# EAGLE design eeZeePower (EAGLE 7.1.0)
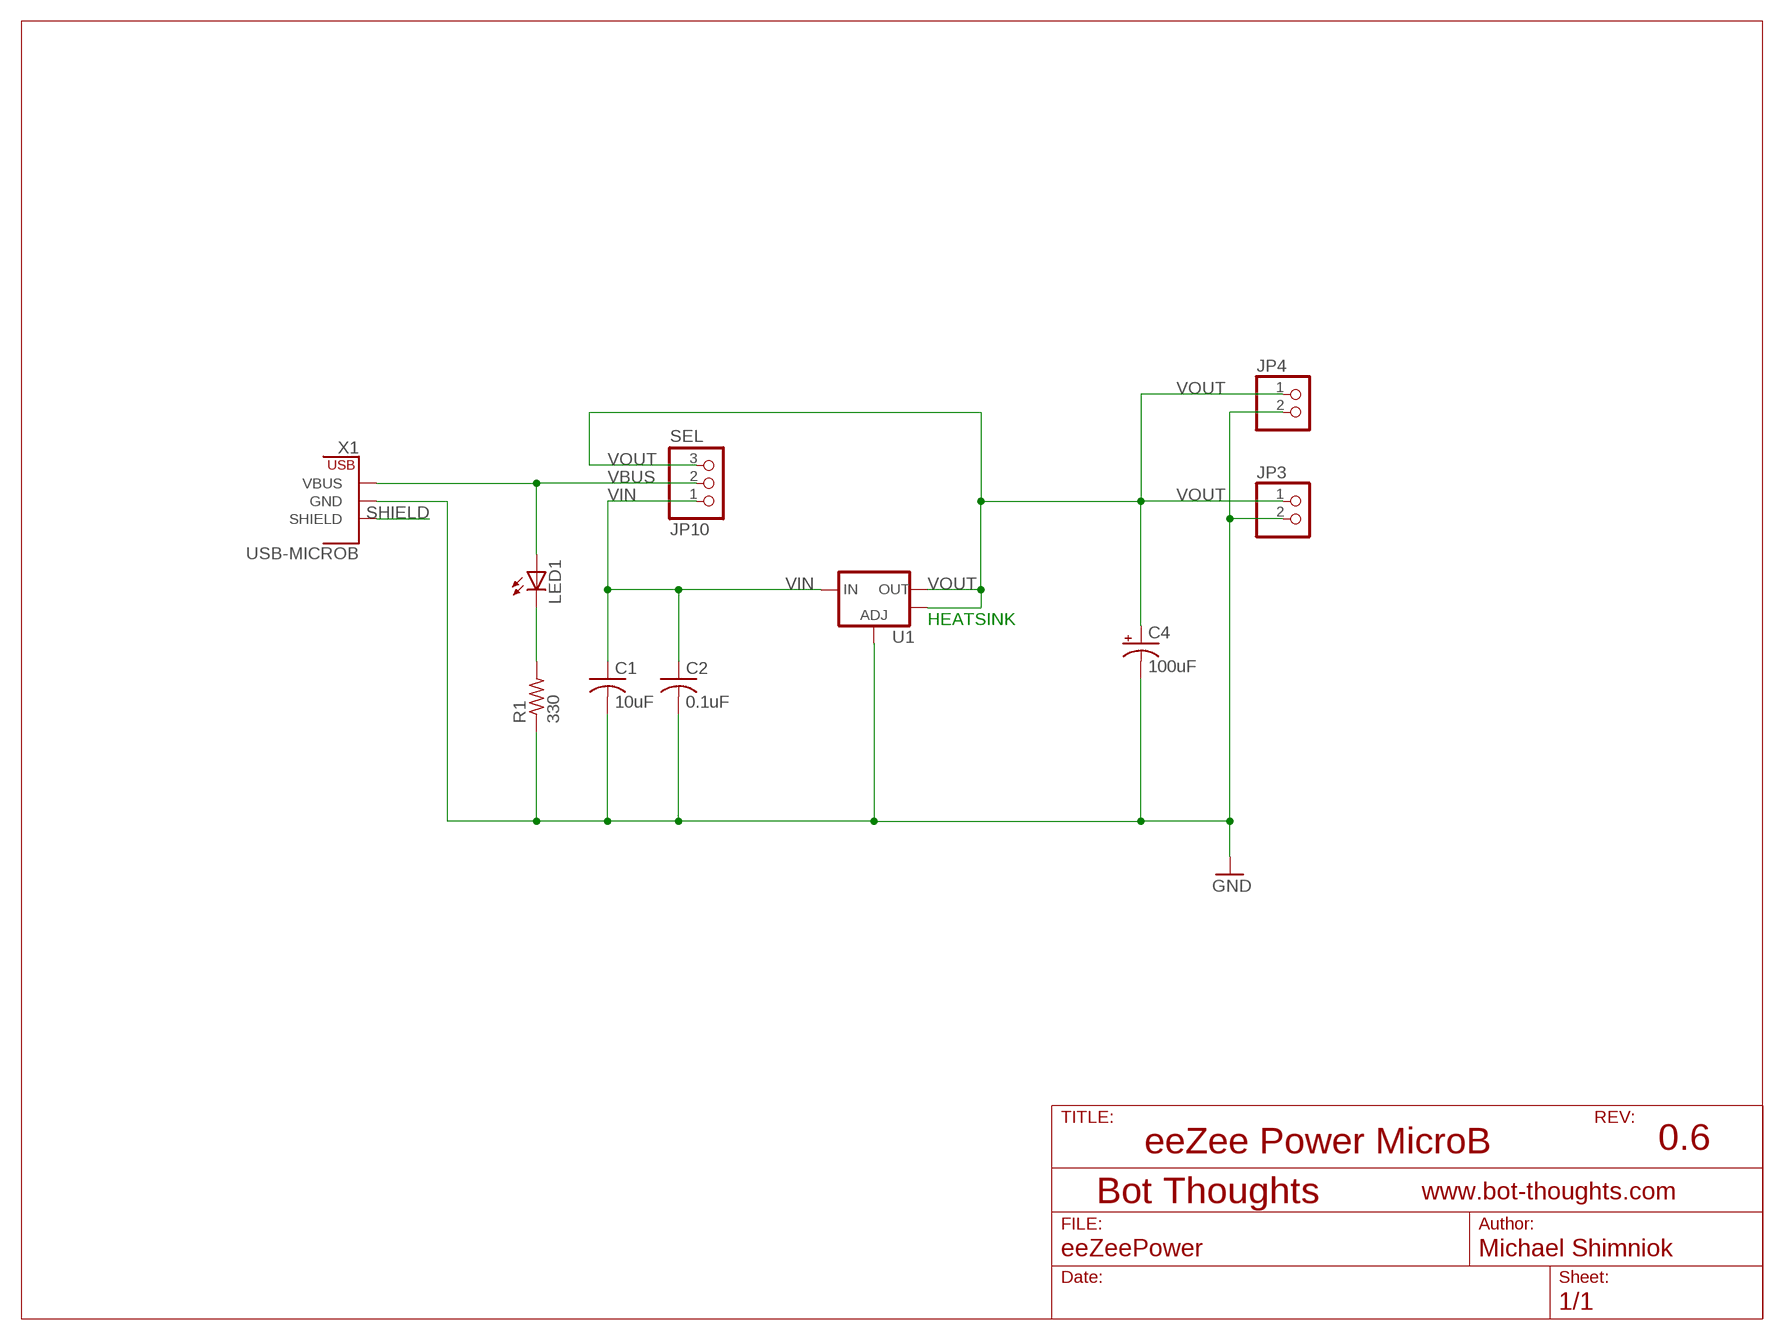
[diagram p0: schematic, sheet 1]

## Parts
C1  10uF  C-USC1206  [C1206]
C2  0.1uF  C-USC0603  [C0603]
C4  100uF  CPOL-USSMCB  [SMC_B]
JP3  PINHD-1X02_2.54-S  [1X02-S]
JP4  PINHD-1X02_2.54-S  [1X02-S]
JP10  SEL  PINHD-1X03_2.54-S  [1X03-S]
LED1  LEDCHIPLED_1206  [CHIPLED_1206]
R1  330  R-US_R0603  [R0603]
U1  V_REG_LM1117SOT223  [SOT223]
X1  USB-MICROB  USB_POWER-UB-4  [USB-MICROB-4]

## Nets
GND: C1.2 C2.2 C4.- JP3.2 JP4.2 R1.1 U1.1(ADJ) X1.GND
N$5: LED1.C R1.2
SHIELD: X1.SHIELD1(SHIELD) X1.SHIELD2(SHIELD) X1.SHIELD3(SHIELD) X1.SHIELD4(SHIELD) X1.SHIELD5(SHIELD) X1.SHIELD6(SHIELD)
VBUS: JP10.2 LED1.A X1.VBUS
VIN: C1.1 C2.1 JP10.1 U1.3(IN)
VOUT: C4.+ JP3.1 JP4.1 JP10.3 U1.2(OUT) U1.4(OUT)

## Notes on the sheet
- HEATSINK
- eeZee Power MicroB | 0.6

## Library data of the parts
C1 C2 = rcl:C-US: CAPACITOR, American symbol
C4 = rcl:CPOL-US: POLARIZED CAPACITOR, American symbol
JP3 JP4 = pinhead-2:PINHD-1X02: PIN HEADER
JP10 = pinhead-2:PINHD-1X03: PIN HEADER
LED1 = led:LED: LED OSRAM: - CHIPLED LG R971, LG N971, LY N971, LG Q971, LY Q971, LO R971, LY R971 LH N974, LH R974 LS Q976, LO Q976, LY Q976 LO Q996 - Hyper CHIPLED LW Q18S LB Q993, LB Q99A, LB R99A - SideLED LS A670, LO A670, LY A670, LG A670, LP A670 LB A673, LV A673, LT A673, LW A673 LH A674 LY A675 LS A676, LA A676, LO A676, LY A676, LW A676 LS A679, LY A679, LG A679 - Hyper Micro SIDELED® LS Y876, LA Y876, LO Y876, LY Y876 LT Y87S - SmartLED LW L88C, LW L88S LB L89C, LB L89S, LG L890 LS L89K, LO L89K, LY L89K LS L896, LA L896, LO L896, LY L896 - TOPLED LS T670, LO T670, LY T670, LG T670, LP T670 LSG T670, LSP T670, LSY T670, LOP T670, LYG T670 LG T671, LOG T671, LSG T671 LB T673, LV T673, LT T673, LW T673 LH T674 LS T676, LA T676, LO T676, LY T676, LB T676, LH T676, LSB T676, LW T676 LB T67C, LV T67C, LT T67C, LS T67K, LO T67K, LY T67K, LW E67C LS E67B, LA E67B, LO E67B, LY E67B, LB E67C, LV E67C, LT E67C LW T67C LS T679, LY T679, LG T679 LS T770, LO T770, LY T770, LG T770, LP T770 LB T773, LV T773, LT T773, LW T773 LH T774 LS E675, LA E675, LY E675, LS T675 LS T776, LA T776, LO T776, LY T776, LB T776 LHGB T686 LT T68C, LB T68C - Hyper Mini TOPLED® LB M676 - Mini TOPLED Santana® LG M470 LS M47K, LO M47K, LY M47K Source: http://www.osram.convergy.de LUXEON: - LUMILED® LXK2-PW12-R00, LXK2-PW12-S00, LXK2-PW14-U00, LXK2-PW14-V00 LXK2-PM12-R00, LXK2-PM12-S00, LXK2-PM14-U00 LXK2-PE12-Q00, LXK2-PE12-R00, LXK2-PE12-S00, LXK2-PE14-T00, LXK2-PE14-U00 LXK2-PB12-K00, LXK2-PB12-L00, LXK2-PB12-M00, LXK2-PB14-N00, LXK2-PB14-P00, LXK2-PB14-Q00 LXK2-PR12-L00, LXK2-PR12-M00, LXK2-PR14-Q00, LXK2-PR14-R00 LXK2-PD12-Q00, LXK2-PD12-R00, LXK2-PD12-S00 LXK2-PH12-R00, LXK2-PH12-S00 LXK2-PL12-P00, LXK2-PL12-Q00, LXK2-PL12-R00 Source: www.luxeon.com KINGBRIGHT: KA-3528ASYC Source: www.kingbright.com
R1 = resistor:R-US_: RESISTOR, American symbol
U1 = SparkFun:V_REG_LM1117: Voltage Regulator LM1117 Standard adjustable voltage regulator but in SMD form. Spark Fun Electronics SKU : COM-00595
X1 = bt_electromech:USB_POWER: USB Power-Only Connector USB connector used only for power exposing VBUS, GND, SHIELD pins only

## Board
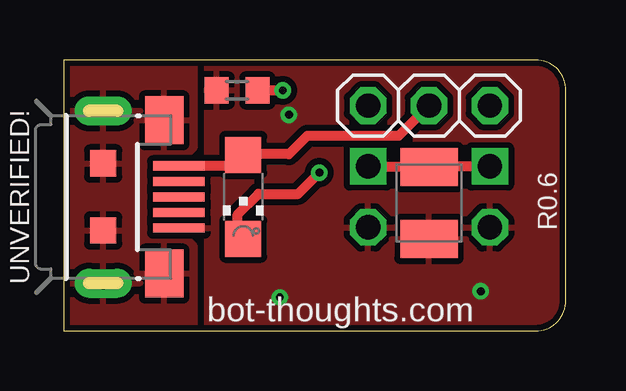
[diagram p1: board, top side]
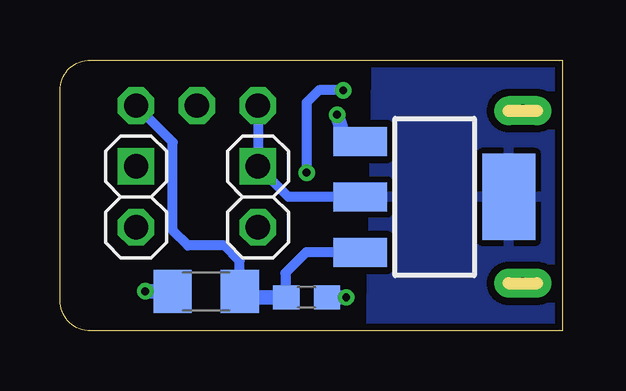
[diagram p2: board, bottom side, seen from below]

Size 20.95 x 11.3 mm. Coordinates in mm from the lower left corner, seen from the top.
Outline: 0,0 19.68,0 arc90 20.95,1.27 20.95,10.03 arc90 19.68,11.3 0,11.3 0,0
Copper layers (1*16): Top 0.0356mm / dielectric 1.5011mm / Bottom 0.0356mm
Design rules "LaenPCBOrder *": minimum track width 6mil, minimum drill 13mil, track to track 10mil, track to pad 10mil, pad to pad 10mil, via to via 10mil, smd to smd 8mil, copper to edge 10mil, drill to drill 10mil, minimum pad ring 7mil, minimum via ring 7mil, stop-mask expansion 3mil, vias tented up to drill 20mil, thermal gap 10mil

### Footprints (pad centres in the part's own frame; a part is rotated, then mirrored left to right if it is on the bottom)
C1206 = smd 1.6 x 1.8: 1 -1.4,0; 2 1.4,0
C0603 = smd 1.1 x 1: 1 -0.85,0; 2 0.85,0
SMC_B = smd 1.6 x 2.4: + -1.5,0; - 1.5,0
1X02-S = drill 1.016 square: 1 -1.27,0 | drill 1.016 octagon: 2 1.27,0
1X03-S = drill 1.016 octagon: 1 -2.54,0; 2 0,0; 3 2.54,0
CHIPLED_1206 = smd 1.5 x 1.5: A 0,-1.75; C 0,1.75
R0603 = smd 1 x 1.1: 1 -0.85,0; 2 0.85,0
SOT223 = smd 1.219 x 2.235: 1 -2.311,-3.099; 2 0,-3.099; 3 2.311,-3.099 | smd 3.6 x 2.2: 4 0,3.099
USB-MICROB-4 = smd 0.38 x 2.15: D+ 0,3.16; D- -0.65,3.16; GND 1.3,3.16; ID 0.65,3.16; VBUS -1.3,3.16 | smd 2 x 1.6: SHIELD1 -3.2,2.55; SHIELD2 3.2,2.55 | drill 0.5 pad 1.2 long: SHIELD3 -3.6,0; SHIELD4 3.6,0 | smd 1.1 x 1.1: SHIELD5 -1.4,0; SHIELD6 1.4,0

### Placement (x,y rotation side)
C1  14.86,1.65 180 bottom
C2  10.67,1.4 0 bottom
C4  15.24,5.33 270 top
JP3  12.7,5.59 270 bottom
JP4  17.78,5.59 270 bottom
JP10  15.24,9.4 180 top
LED1  7.49,5.59 180 top
R1  7.24,10.03 0 top
U1  5.33,5.59 270 bottom
X1  1.65,5.59 270 top

### Tracks (layer width: path | path; a pad name or v marks a point on that pad's centre or on a via)
GND  (via drill 0.33)
  Bottom 0.61: C2.2 v9.02,1.4 | C1.2 v17.4,1.65 | U1.1 9.04,7.9 v9.4,9.02
  pour Top (rank 3): 5.46,11.43 19.68,11.43 arc-90 20.95,10.16 20.95,1.14 arc-90 19.68,-0.13 5.46,-0.13
N$5  (via drill 0.33)
  Top 0.406: R1.2 v9.14,10.03 | LED1.C 7.27,3.81 7.27,4.85 8.13,5.71 9.78,5.71 v10.67,6.6
  Bottom 0.406: v9.14,10.03 10.16,10.03 10.67,9.53 v10.67,6.6
SHIELD
  pour Top: 0,11.43 5.46,11.43 5.46,7.62 4.95,7.11 4.95,4.06 5.46,3.56 5.46,-0.13 0,-0.13
VBUS
  Top 0.406: 6.79,6.89 LED1.A | JP10.2 13.97,8.13 10.16,8.13 9.4,7.37 7.27,7.37 LED1.A | X1.VBUS 7.17,6.89 LED1.A
VIN
  Bottom 0.406: U1.3 10.69,3.28 11.56,2.41 11.56,1.44 C2.1 | C1.1 13.46,2.92 14.1,3.56 15.62,3.56 16.26,4.19 16.26,7.87 JP10.1
  Bottom 0.61: C1.1 13.21,1.65 12.95,1.4 C2.1
VOUT
  Top 0.406: JP3.1 15.22,6.86 C4.+ 15.26,6.86 JP4.1
  Bottom 0.406: JP10.3 JP3.1 11.43,5.59 U1.2
  pour Bottom (isolate 0.305): 0,11.43 7.75,11.43 8,0.13 0.13,0.13

### Text on the board
tPlace: R0.6 | bot-thoughts.com
tValues: 3V3 | VU | VCC | GND | eeZeePowerμB